# EAGLE design Magnetometer (EAGLE 6.2)
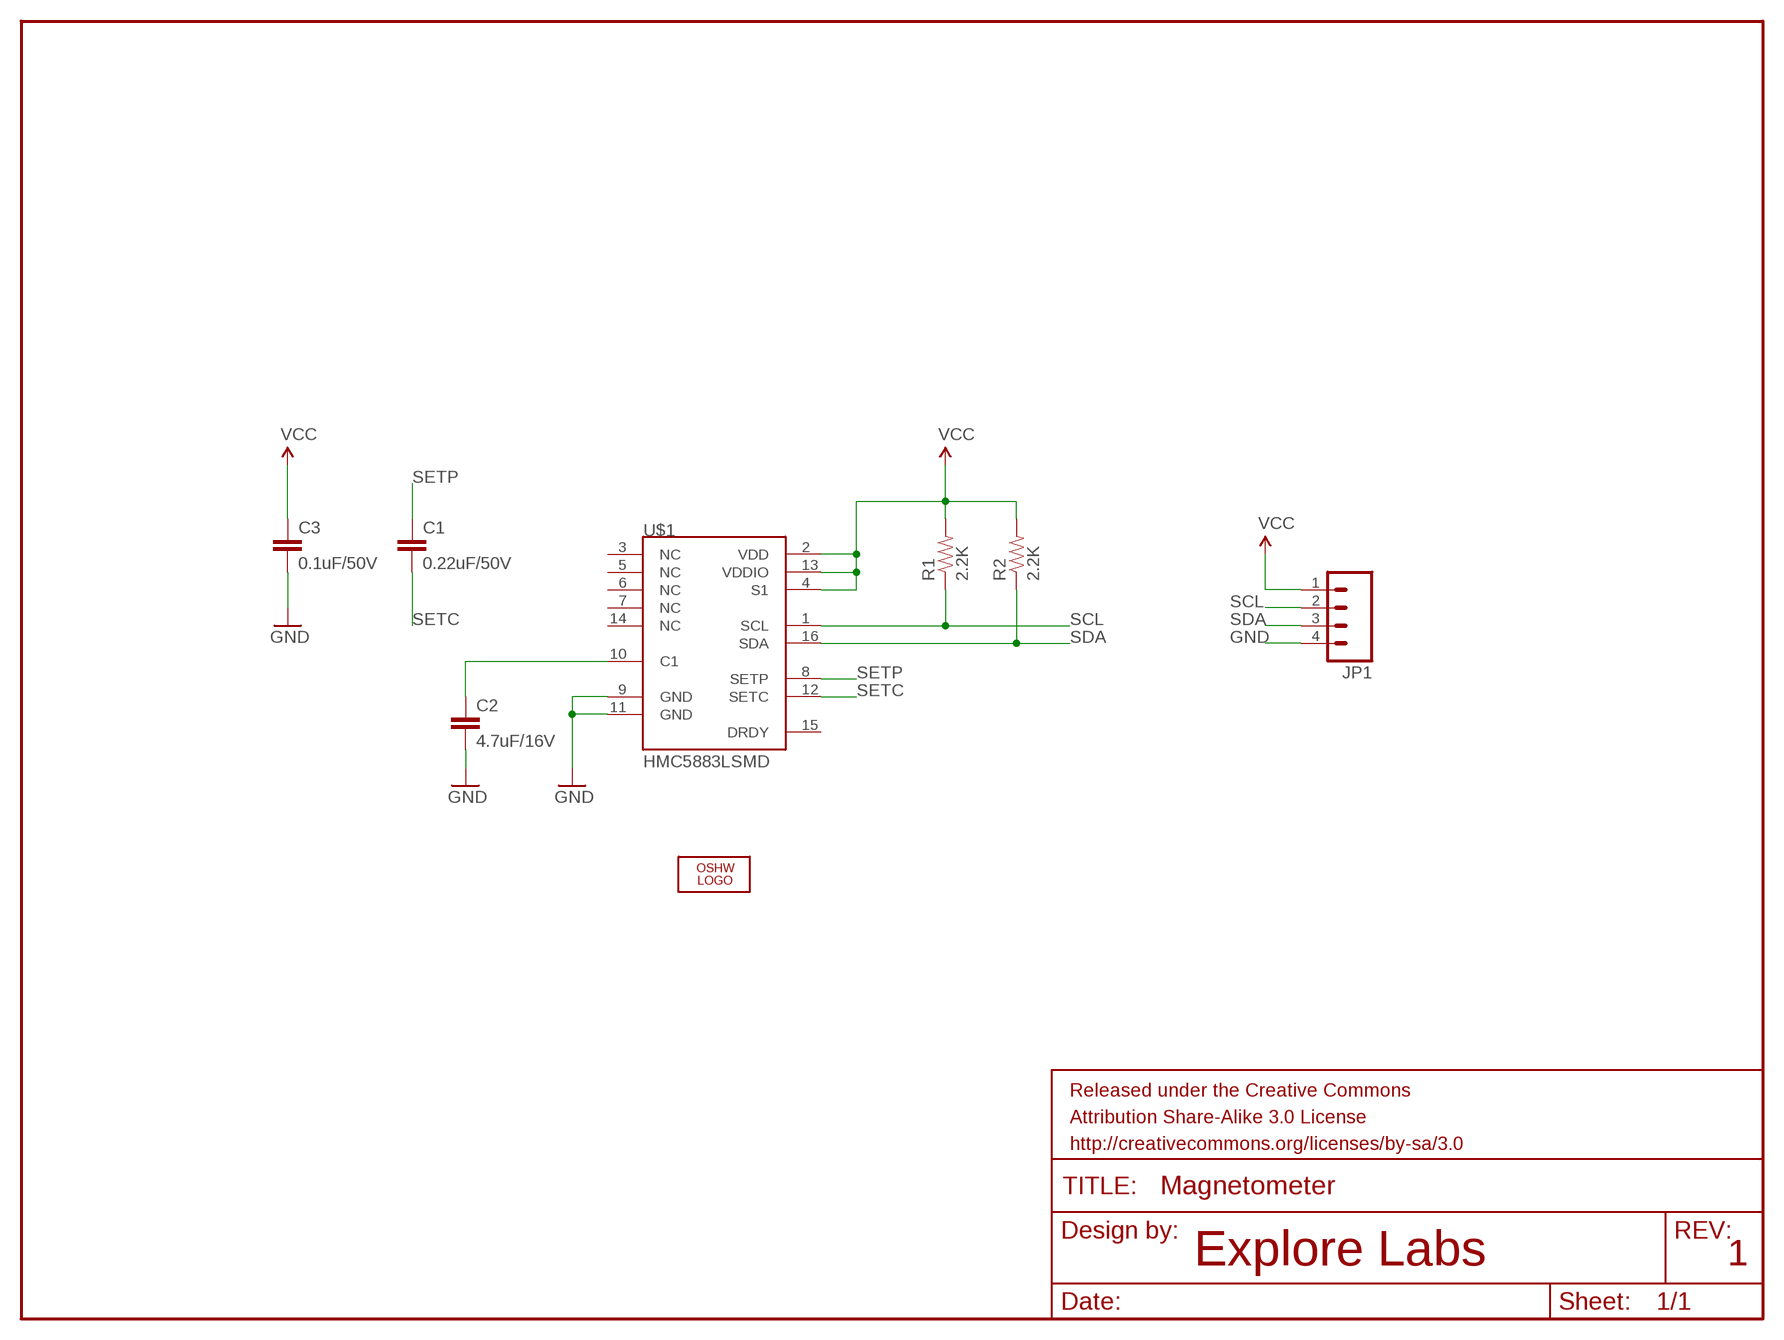
[diagram p0: schematic, sheet 1]

## Parts
C1  0.22uF/50V  CAP1206  [1206]
C2  4.7uF/16V  CAP1206  [1206]
C3  0.1uF/50V  CAP0805  [0805]
JP1  M04PTH  [1X04]
LOGO1  OSHW_LOGO_FILLX0100-NT  [OSHW_FILLX100_NOTEXT]
R1  2.2K  RESISTOR0603-RES  [0603-RES]
R2  2.2K  RESISTOR0603-RES  [0603-RES]
U$1  HMC5883LSMD  [16LPCC]

## Nets
GND: C2.2 C3.2 JP1.4 U$1.9(GND) U$1.11(GND)
N$1: C2.1 U$1.10(C1)
SCL: JP1.2 R1.1 U$1.1(SCL)
SDA: JP1.3 R2.1 U$1.16(SDA)
SETC: C1.2 U$1.12(SETC)
SETP: C1.1 U$1.8(SETP)
VCC: C3.1 JP1.1 R1.2 R2.2 U$1.2(VDD) U$1.4(S1) U$1.13(VDDIO)
Unconnected: U$1.3(NC) U$1.5(NC) U$1.6(NC) U$1.7(NC) U$1.14(NC) U$1.15(DRDY)

## Notes on the sheet
- Explore Labs | 1

## Library data of the parts
C1-C3 = SparkFun-Passives:CAP: Capacitor Standard 0603 ceramic capacitor, and 0.1" leaded capacitor.
JP1 = SparkFun-Connectors:M04: Header 4 Standard 4-pin 0.1" header. Use with straight break away headers (SKU : PRT-00116), right angle break away headers (PRT-00553), swiss pins (PRT-00743), machine pins (PRT-00117), and female headers (PRT-00115). Molex polarized connector foot print use with SKU : PRT-08231 with associated crimp pins and housings. 1MM SMD Version SKU: PRT-10208
LOGO1 = ohw-logo:OSHW_LOGO_FILL
R1 R2 = SparkFun-Passives:RESISTOR: Resistor Basic schematic elements and footprints for 0603, 1206, and PTH resistors.
U$1 = SparkFun-Sensors:HMC5883L: 3 Axis Digital Compass IC

## Board
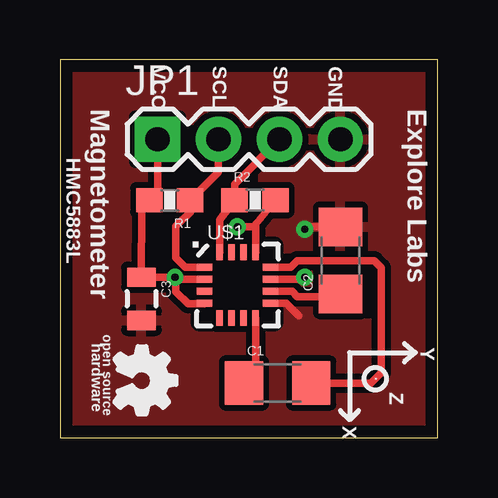
[diagram p1: board, top side]
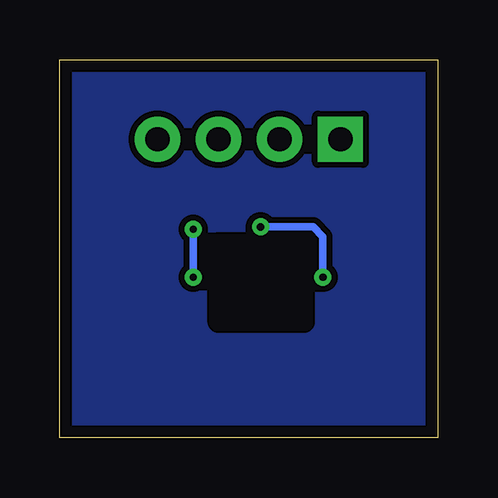
[diagram p2: board, bottom side, seen from below]

Size 15.75 x 15.75 mm. Coordinates in mm from the lower left corner, seen from the top.
Outline: 0,0 15.75,0 15.75,15.75 0,15.75 0,0
Copper layers (1*16): Top 0.035mm / dielectric 1.5mm / Bottom 0.035mm
Design rules: minimum track width 10mil, minimum drill 24mil, track to track 8mil, track to pad 8mil, pad to pad 8mil, via to via 8mil, smd to smd 8mil, copper to edge 20mil, drill to drill 8mil, minimum pad ring 10mil, minimum via ring 8mil, stop-mask expansion 4mil, vias tented up to drill 0mil, thermal gap 10mil
tRestrict: area 5.8,4.8 to 8.9,8; 5 lines
bRestrict: area 5.6,4.8 to 9.1,8.1

### Footprints (pad centres in the part's own frame; a part is rotated, then mirrored left to right if it is on the bottom)
1206 = smd 1.6 x 1.8: 1 -1.4,0; 2 1.4,0
0805 = smd 0.8 x 1.2: 1 -0.9,0; 2 0.9,0
1X04 = drill 1.016 pad 1.88 square: 1 0,0 | drill 1.016 pad 1.88: 2 2.54,0; 3 5.08,0; 4 7.62,0
0603-RES = smd 1.1 x 1: 1 -0.85,0; 2 0.85,0
16LPCC = smd 0.65 x 0.28: 1 -1.37,0.75; 2 -1.37,0.25; 3 -1.37,-0.25; 4 -1.37,-0.75; 9 1.37,-0.75; 10 1.37,-0.25; 11 1.37,0.25; 12 1.37,0.75 | smd 0.28 x 0.65: 5 -0.75,-1.37; 6 -0.25,-1.37; 7 0.25,-1.37; 8 0.75,-1.37; 13 0.75,1.37; 14 0.25,1.37; 15 -0.25,1.37; 16 -0.75,1.37

### Placement (x,y rotation side)
C1  9.07,2.29 0 top
C2  11.68,7.4 90 top
C3  3.39,5.8 270 top
JP1  4.06,12.45 0 top
LOGO1  2.29,3.81 270 top
R1  4.57,9.91 180 top
R2  8.13,9.91 0 top
U$1  7.4,6.37 0 top

### Tracks (layer width: path | path; a pad name or v marks a point on that pad's centre or on a via)
GND  (via drill 0.3)
  Top 0.305: U$1.11 10.12,6.62 v10.19,6.69 | C2.2 11.6,8.8 11.59,8.79 10.29,8.79 v10.19,8.69 | U$1.9 9.42,5.62 9.95,5.09
  Bottom 0.305: v10.19,6.69 v10.19,8.69 10.19,8.79
  pour Top (isolate 0.254): 0,15.75 15.75,15.75 15.75,0 0,0
N$1
  Top 0.305: U$1.10 9.67,6.12 9.89,5.89 11.59,5.89 C2.1
N$2
  pour Bottom (isolate 0.254): 0,15.75 15.75,15.75 15.75,0 0,0
SCL
  Top 0.305: U$1.1 5.22,7.12 4.82,7.52 4.82,8.82 5.44,9.43 R1.1 6.6,11.07 JP1.2
SDA
  Top 0.305: U$1.16 6.65,9.1 R2.1 7.28,10.58 JP1.3
SETC
  Top 0.305: U$1.12 9.62,7.12 9.89,7.39 13.09,7.39 13.39,7.09 13.39,2.72 12.95,2.29 C1.2
SETP
  Top 0.305: C1.1 8.15,2.77 U$1.8
VCC  (via drill 0.3)
  Top 0.305: U$1.13 8.15,8.9 | 8.15,8.9 R2.2 | R1.2 4.06,10.23 | 4.06,10.23 JP1.1 | v7.39,8.79 8.04,8.79 8.15,8.9 | 4.06,10.23 3.4,9.56 C3.1 v4.79,6.69 4.87,6.62 U$1.2 4.84,6.62 4.83,6.6 4.83,6.1 5.33,5.59 6,5.59 U$1.4
  Bottom 0.305: v4.79,6.69 4.79,8.39 5.19,8.79 v7.39,8.79

### Text on the board
_tsilk: VCC | SCL | SDA | GND | Magnetometer | Explore Labs | HMC5883L | . | hardware | open source | Y | . | Z | X